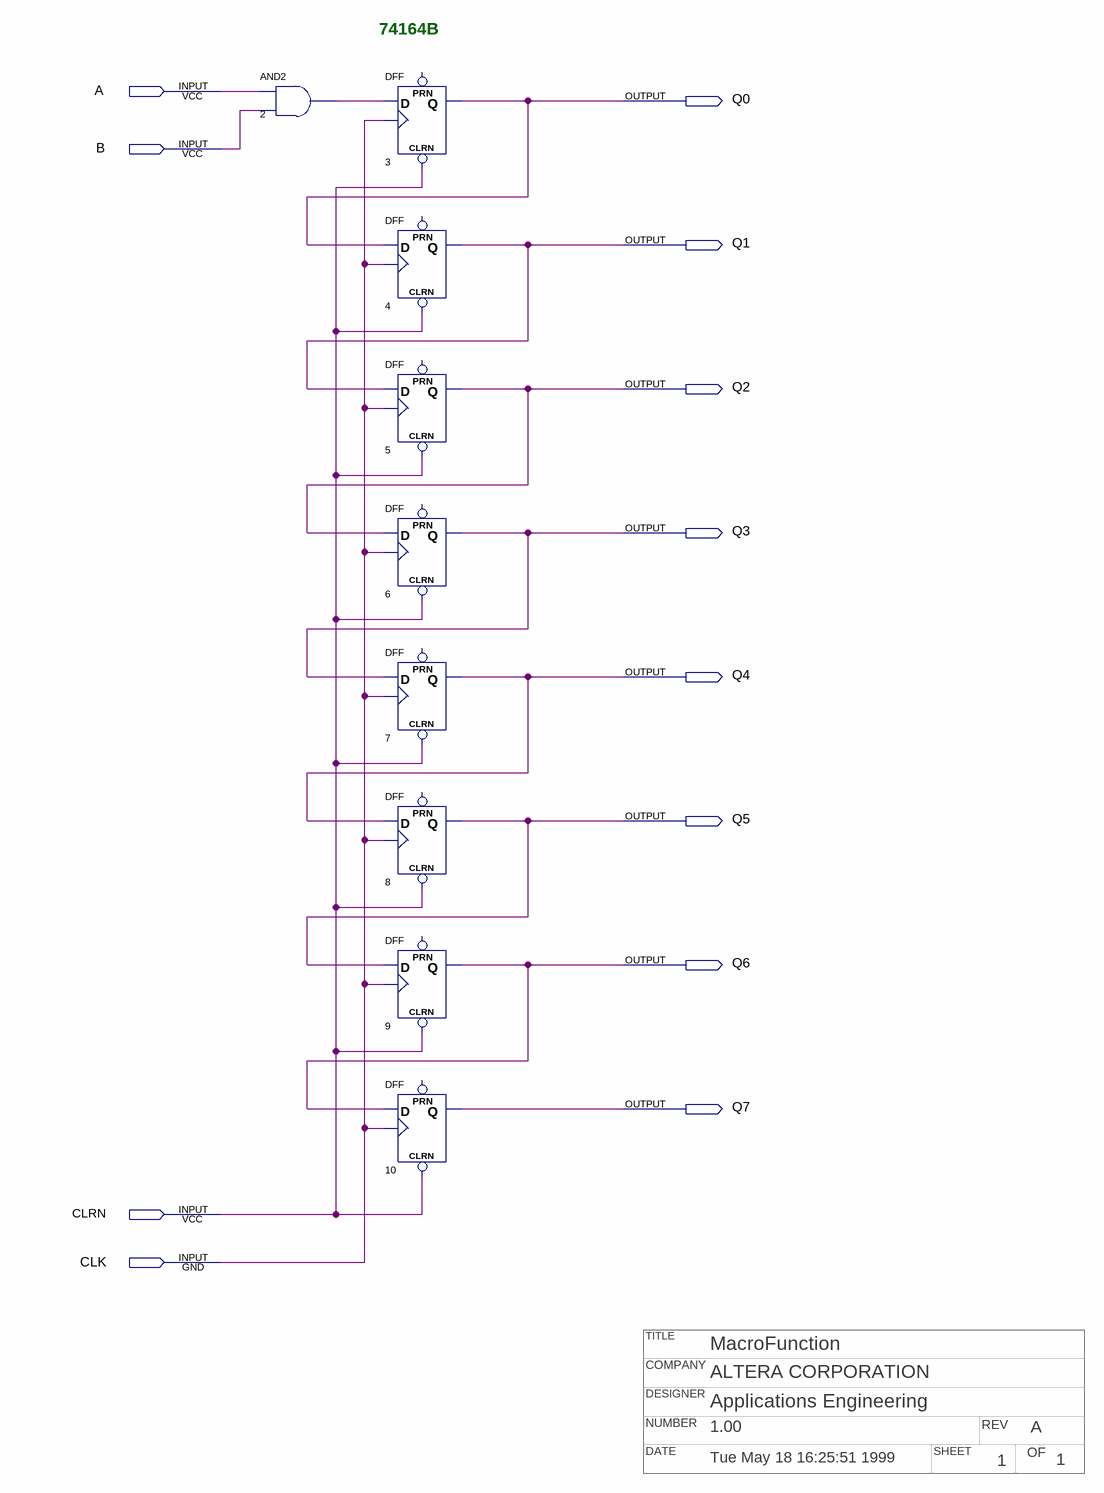
[diagram p0: schematic sheet]
// Quartus schematic 74164b.bdf as structural Verilog: 9 symbols, 12 pins
// Title block: TITLE: MacroFunction; COMPANY: ALTERA CORPORATION; DESIGNER: Applications Engineering; NUMBER: 1.00; REV: A; DATE: Tue May 18 16:25:51 1999; SHEET: 1; OF: 1
module \74164b  (
  input  A,
  input  B,
  input  CLRN,
  input  CLK,
  output Q0,
  output Q1,
  output Q2,
  output Q3,
  output Q4,
  output Q5,
  output Q6,
  output Q7
);

  wire n2_out;

  and u_2 (n2_out, A, B);
  DFF u_3 (.CLRN(CLRN), .CLK(CLK), .D(n2_out), .Q(Q0));  // open: PRN
  DFF u_4 (.CLRN(CLRN), .CLK(CLK), .D(Q0), .Q(Q1));  // open: PRN
  DFF u_5 (.CLRN(CLRN), .CLK(CLK), .D(Q1), .Q(Q2));  // open: PRN
  DFF u_6 (.CLRN(CLRN), .CLK(CLK), .D(Q2), .Q(Q3));  // open: PRN
  DFF u_7 (.CLRN(CLRN), .CLK(CLK), .D(Q3), .Q(Q4));  // open: PRN
  DFF u_8 (.CLRN(CLRN), .CLK(CLK), .D(Q4), .Q(Q5));  // open: PRN
  DFF u_9 (.CLRN(CLRN), .CLK(CLK), .D(Q5), .Q(Q6));  // open: PRN
  DFF u_10 (.CLRN(CLRN), .CLK(CLK), .D(Q6), .Q(Q7));  // open: PRN

  // Notes on the sheet:
  //   74164B
endmodule
